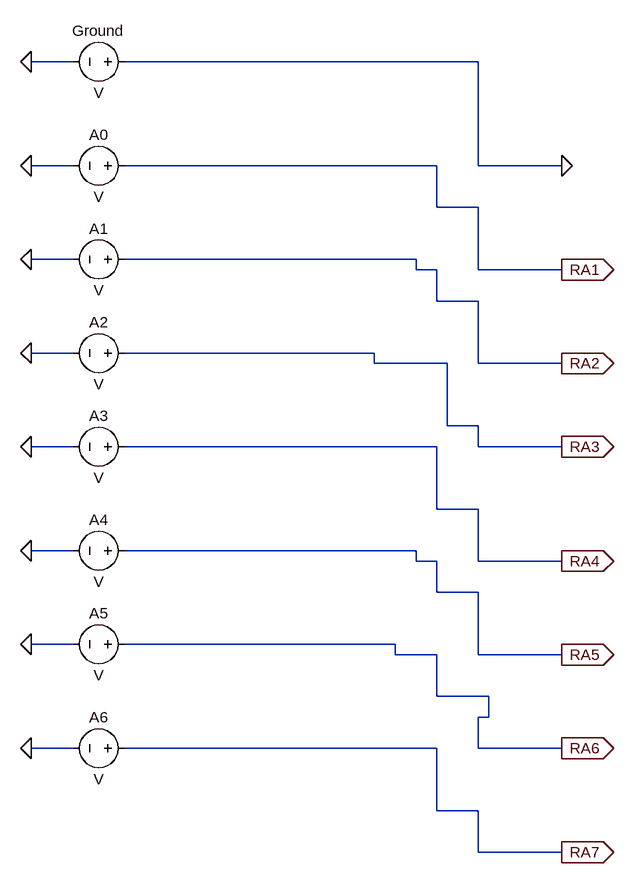
[diagram p0: schematic 8SL.asc]
8SL.asc, the LTspice schematic file:
Version 4.1
SHEET 1 984 1088
WIRE 32 -240 -32 -240
WIRE 656 -240 112 -240
WIRE 32 -80 -32 -80
WIRE 592 -80 112 -80
WIRE 656 -80 656 -240
WIRE 784 -80 656 -80
WIRE 592 -16 592 -80
WIRE 656 -16 592 -16
WIRE 32 64 -32 64
WIRE 560 64 112 64
WIRE 560 80 560 64
WIRE 592 80 560 80
WIRE 656 80 656 -16
WIRE 784 80 656 80
WIRE 592 128 592 80
WIRE 656 128 592 128
WIRE 32 208 -32 208
WIRE 496 208 112 208
WIRE 496 224 496 208
WIRE 608 224 496 224
WIRE 656 224 656 128
WIRE 784 224 656 224
WIRE 608 320 608 224
WIRE 656 320 608 320
WIRE 32 352 -32 352
WIRE 592 352 112 352
WIRE 656 352 656 320
WIRE 784 352 656 352
WIRE 592 448 592 352
WIRE 656 448 592 448
WIRE 32 512 -32 512
WIRE 560 512 112 512
WIRE 560 528 560 512
WIRE 592 528 560 528
WIRE 656 528 656 448
WIRE 784 528 656 528
WIRE 592 576 592 528
WIRE 656 576 592 576
WIRE 32 656 -32 656
WIRE 528 656 112 656
WIRE 528 672 528 656
WIRE 592 672 528 672
WIRE 656 672 656 576
WIRE 784 672 656 672
WIRE 592 736 592 672
WIRE 672 736 592 736
WIRE 672 768 672 736
WIRE 672 768 656 768
WIRE 32 816 -32 816
WIRE 592 816 112 816
WIRE 656 816 656 768
WIRE 784 816 656 816
WIRE 592 912 592 816
WIRE 656 912 592 912
WIRE 656 976 656 912
WIRE 784 976 656 976
FLAG -32 -80 0
FLAG -32 64 0
FLAG -32 208 0
FLAG -32 352 0
FLAG -32 512 0
FLAG -32 656 0
FLAG -32 816 0
FLAG -32 -240 0
FLAG 784 80 RA1
IOPIN 784 80 Out
FLAG 784 224 RA2
IOPIN 784 224 Out
FLAG 784 352 RA3
IOPIN 784 352 Out
FLAG 784 528 RA4
IOPIN 784 528 Out
FLAG 784 672 RA5
IOPIN 784 672 Out
FLAG 784 816 RA6
IOPIN 784 816 Out
FLAG 784 976 RA7
IOPIN 784 976 Out
FLAG 784 -80 0
SYMBOL voltage 128 -80 R90
WINDOW 0 -32 56 VBottom 2
WINDOW 3 32 56 VTop 2
SYMATTR InstName A0
SYMBOL voltage 128 64 R90
WINDOW 0 -32 56 VBottom 2
WINDOW 3 32 56 VTop 2
SYMATTR InstName A1
SYMBOL voltage 128 208 R90
WINDOW 0 -32 56 VBottom 2
WINDOW 3 32 56 VTop 2
SYMATTR InstName A2
SYMBOL voltage 128 352 R90
WINDOW 0 -32 56 VBottom 2
WINDOW 3 32 56 VTop 2
SYMATTR InstName A3
SYMBOL voltage 128 512 R90
WINDOW 0 -32 56 VBottom 2
WINDOW 3 32 56 VTop 2
SYMATTR InstName A4
SYMBOL voltage 128 656 R90
WINDOW 0 -32 56 VBottom 2
WINDOW 3 32 56 VTop 2
SYMATTR InstName A5
SYMBOL voltage 128 816 R90
WINDOW 0 -32 56 VBottom 2
WINDOW 3 32 56 VTop 2
SYMATTR InstName A6
SYMBOL voltage 128 -240 R90
WINDOW 0 -32 56 VBottom 2
WINDOW 3 32 56 VTop 2
SYMATTR InstName Ground

The netlist it stands for:
* 8SL.asc
V§A0 RA1 0 V
V§A1 RA2 0 V
V§A2 RA3 0 V
V§A3 RA4 0 V
V§A4 RA5 0 V
V§A5 RA6 0 V
V§A6 RA7 0 V
V§Ground 0 0 V
.backanno
.end